# EAGLE board half (EAGLE 9.0.0)
REV: D
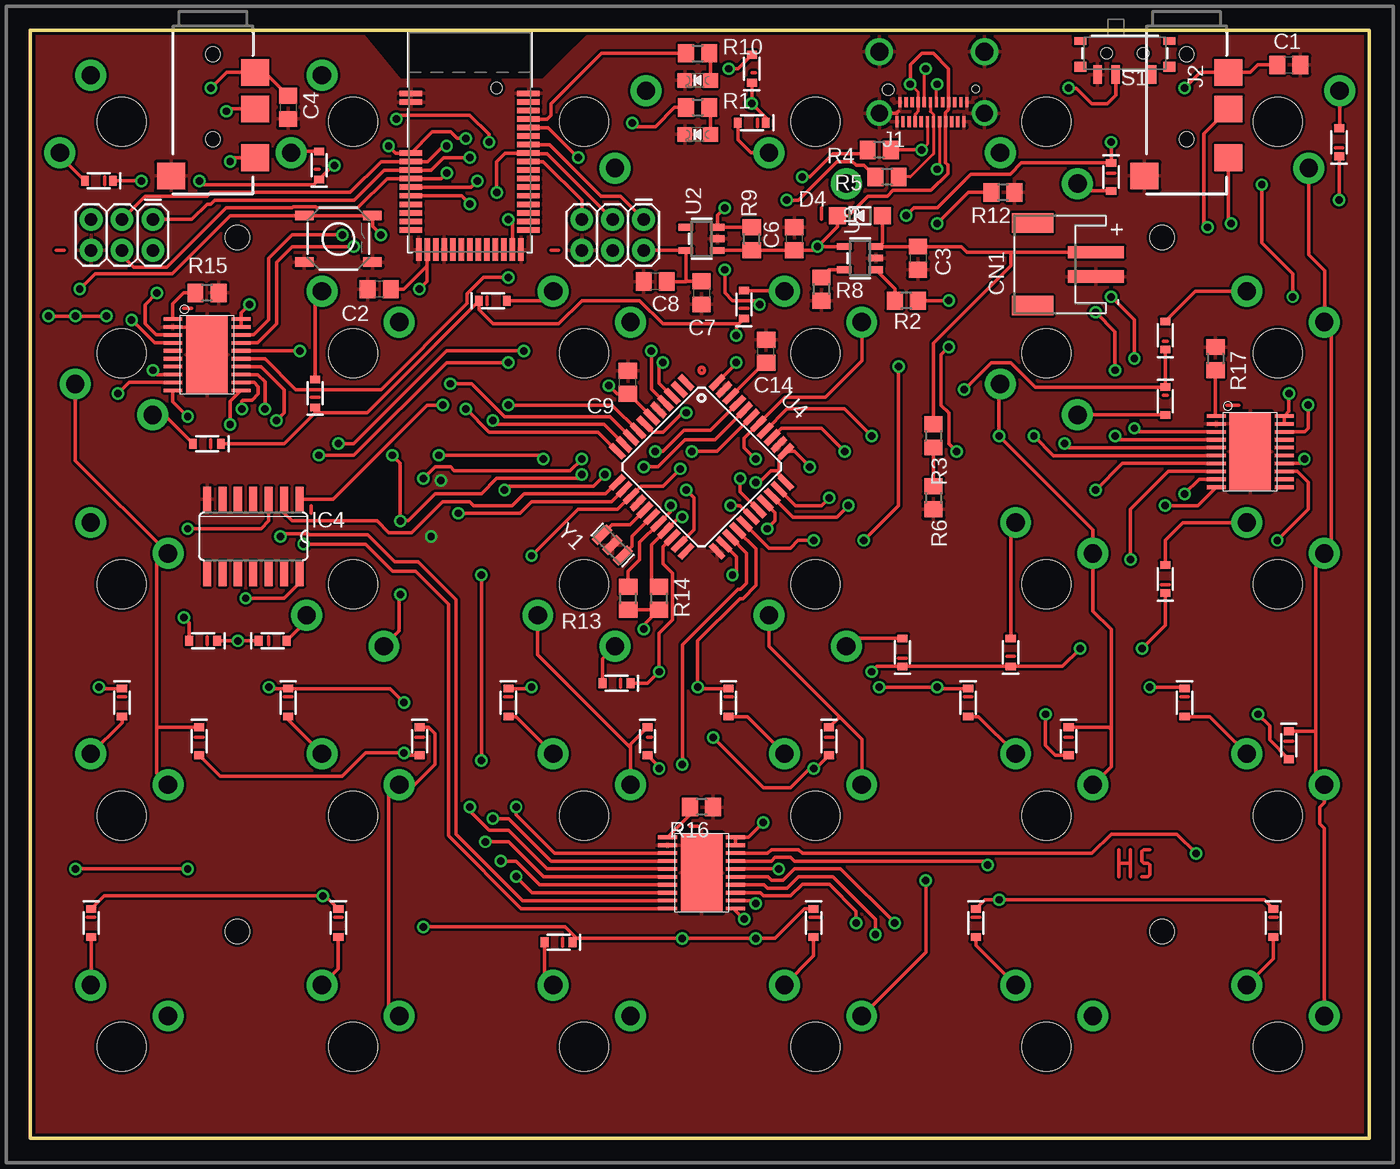
[diagram p3: board, top side]
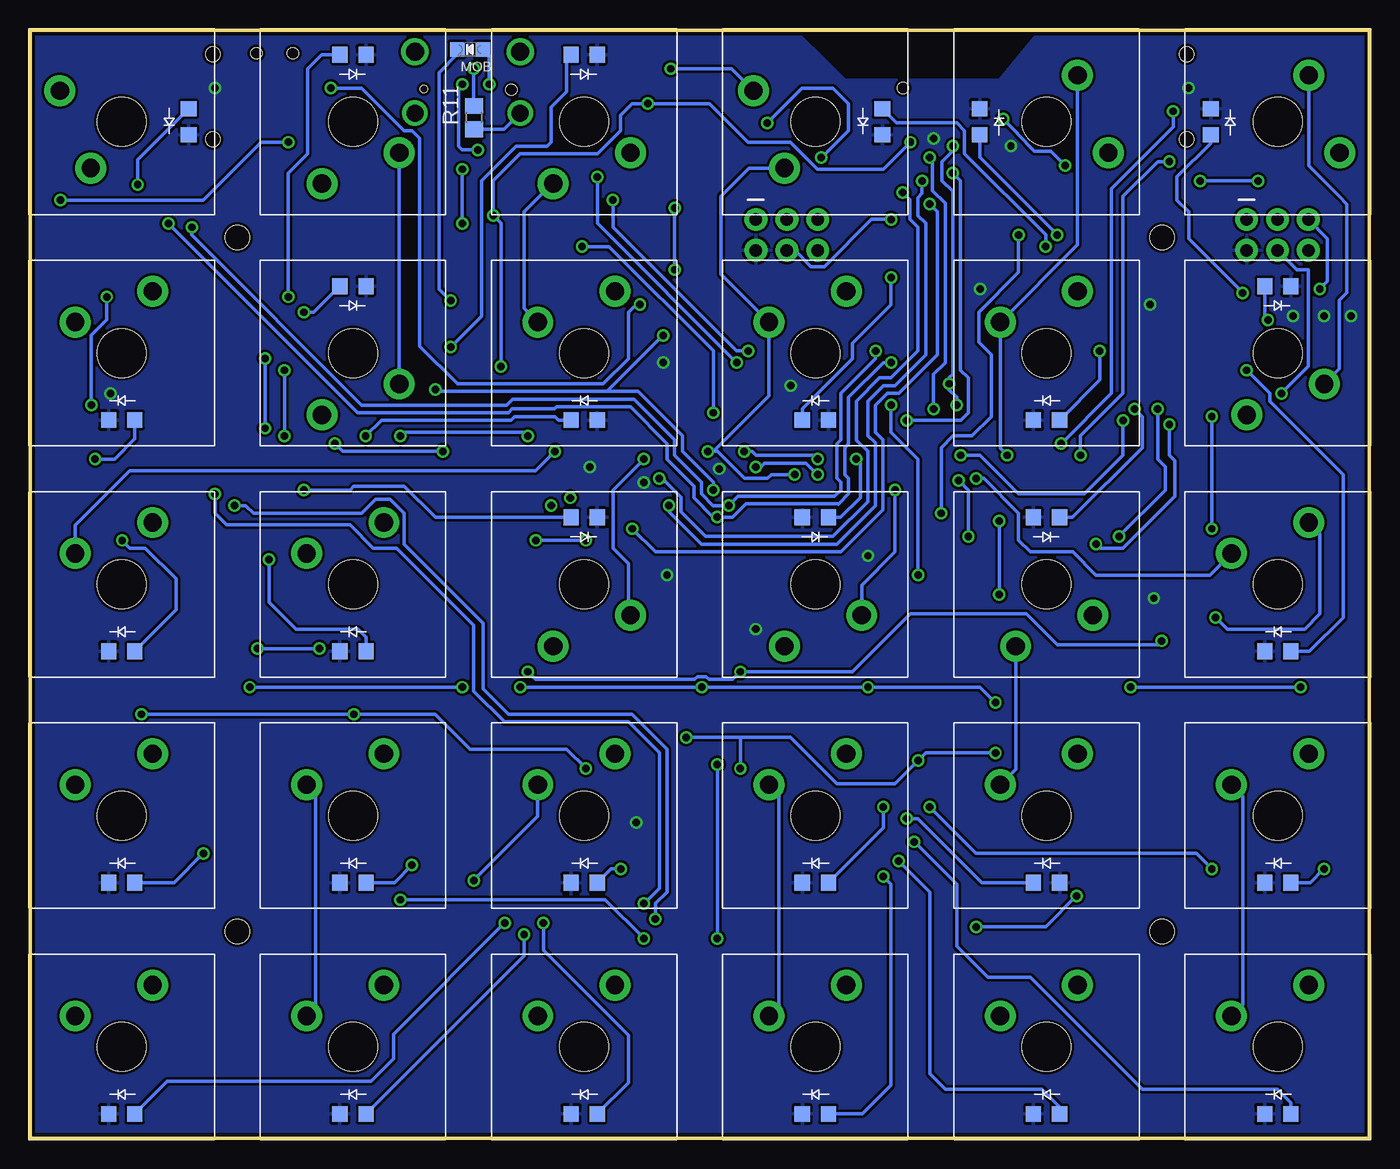
[diagram p4: board, bottom side, seen from below]

Size 110 x 91 mm. Coordinates in mm from the lower left corner, seen from the top.
Outline: 0,0 110,0 110,91 0,91 0,0
Copper layers (1*16): Top 0.035mm / dielectric 1.5mm / Bottom 0.035mm
Design rules "adafruit *": minimum track width 10mil, minimum drill 0.5mm, track to track 8mil, track to pad 8mil, pad to pad 8mil, via to via 8mil, smd to smd 8mil, copper to edge 10mil, drill to drill 8mil, minimum pad ring 10mil, minimum via ring 8mil, stop-mask expansion 2mil, vias tented up to drill 25mil, thermal gap 10mil
Holes 2 mm at 93,74 93,17 17,17 17,74
tKeepout: area 15.2,72.2 to 18.8,75.8; area 91.2,72.2 to 94.8,75.8; area 91.2,15.2 to 94.8,18.8; area 15.2,15.2 to 18.8,18.8

## Footprints (pad centres in the part's own frame; a part is rotated, then mirrored left to right if it is on the bottom)
C0805 = smd 1.3 x 1.5: 1 -0.95,0; 2 0.95,0
JST-PH-2-SMT-RA = smd 1 x 4.6: 1 1,-3.7; 2 -1,-3.7 | smd 1.6 x 3.4: NC1 -3.4,1.5; NC2 3.4,1.5
CHIPLED_0805_NOOUTLINE = smd 1.2 x 1.2: A 0,-1.05; C 0,1.05
SOD-323 = smd 0.63 x 0.83: A 1.15,0; C -1.15,0
SOD-123 = smd 1.4 x 1.4: A 1.85,0; C -1.85,0
HTSSOP20DAP = smd 0.3 x 1.55: 1 -2.925,-2.8; 2 -2.275,-2.8; 3 -1.625,-2.8; 4 -0.975,-2.8; 5 -0.325,-2.8; 6 0.325,-2.8; 7 0.975,-2.8; 8 1.625,-2.8; 9 2.275,-2.8; 10 2.925,-2.8; 11 2.925,2.8; 12 2.275,2.8; 13 1.625,2.8; 14 0.975,2.8; 15 0.325,2.8; 16 -0.325,2.8; 17 -0.975,2.8; 18 -1.625,2.8; 19 -2.275,2.8; 20 -2.925,2.8 | smd 6.5 x 3.4: EXP 0,0
SO14 = smd 0.66 x 2.032: 1 -3.81,-3.073; 2 -2.54,-3.073; 3 -1.27,-3.073; 4 0,-3.073; 5 1.27,-3.073; 6 2.54,-3.073; 7 3.81,-3.073; 8 3.81,3.073; 9 2.54,3.073; 10 1.27,3.073; 11 0,3.073; 12 -1.27,3.073; 13 -2.54,3.073; 14 -3.81,3.073
DX07S0224JJ2_USB-C = smd 0.27 x 0.9: A1 0.975,2.7; A2 1.475,2.7; A3 1.975,2.7; A4 2.475,2.7; A5 2.975,2.7; A6 3.475,2.7; A7 3.975,2.7; A8 4.475,2.7; A9 4.975,2.7; A10 5.475,2.7; A11 5.975,2.7; A12 6.475,2.7 | smd 0.27 x 0.8: B1 6.225,1.1; B2 5.725,1.1; B3 5.225,1.1; B4 4.725,1.1; B5 4.225,1.1; B6 3.725,1.1; B7 3.225,1.1; B8 2.725,1.1; B9 2.225,1.1; B10 1.725,1.1; B11 1.225,1.1; B12 0.725,1.1 | drill 1.4: SHIELD0 -0.72,2; SHIELD1 7.92,2 | drill 1.5: SHIELD2 7.92,-3.05; SHIELD3 -0.72,-3.05 | hole 0.6: 0,0; 0,0 | hole 0.9: 7.2,0.065
AUDIO_JACK_3.5MM_TRRS_SMD_CUI = smd 2.2 x 2.3: EARTH 12.3,-3.45; RING1 6.8,3.45; RING2 3.8,3.45; TIP 10.8,3.45 | hole 1.2: 2.3,0; 9.3,0
2X3 = drill 1.016 pad 1.88: 1 0,0; 2 0,2.54; 3 2.54,0; 4 2.54,2.54; 5 5.08,0; 6 5.08,2.54
R0805 = smd 1.3 x 1.5: 1 -0.95,0; 2 0.95,0
SWITCH_SPST_SMD_A = smd 0.7 x 1.5: 1 -2.25,-1.75; 2 -0.75,-1.75; 3 2.25,-1.75 | smd 1 x 0.6: GND1 -3.65,1; GND3 3.65,1 | smd 1 x 0.8: GND2 -3.65,-1.1; GND4 3.65,-1.1 | hole 0.9: -1.5,0; 1.5,0
TACTILE_SWITCH_SMD_5.2MM = smd 1.524 x 0.762: 1 -2.794,1.905; 2 2.794,1.905; 3 -2.794,-1.905; 4 2.794,-1.905
CHERRY-MX-PM-SMDLED = smd 1.25 x 1.3: LN -1.075,-5.5; LP 1.075,-5.5 | drill 1.5 pad 2.54: SW1 -3.81,2.54; SW2 2.54,5.08 | hole 4: 0,0
BLE_MODULE_RAYTAC_MDBT40 = smd 1.85 x 0.45: 1 -4.825,4; 2 -4.825,3.3; 3 -4.825,-0.9; 4 -4.825,-1.6; 5 -4.825,-2.3; 6 -4.825,-3; 7 -4.825,-3.7; 8 -4.825,-4.4; 9 -4.825,-5.1; 10 -4.825,-5.8; 11 -4.825,-6.5; 12 -4.825,-7.2; 26 4.825,-7.2; 27 4.825,-6.5; 28 4.825,-5.8; 29 4.825,-5.1; 30 4.825,-4.4; 31 4.825,-3.7; 32 4.825,-3; 33 4.825,-2.3; 34 4.825,-1.6; 35 4.825,-0.9; 36 4.825,-0.2; 37 4.825,0.5; 38 4.825,1.2; 39 4.825,1.9; 40 4.825,2.6; 41 4.825,3.3; 42 4.825,4 | smd 0.45 x 1.85: 13 -4.2,-8.825; 14 -3.5,-8.825; 15 -2.8,-8.825; 16 -2.1,-8.825; 17 -1.4,-8.825; 18 -0.7,-8.825; 19 0,-8.825; 20 0.7,-8.825; 21 1.4,-8.825; 22 2.1,-8.825; 23 2.8,-8.825; 24 3.5,-8.825; 25 4.2,-8.825 | hole 0.9: 2.2,4.45
SOT23-5 = smd 0.55 x 1.2: 1 -0.95,-1.3; 2 0,-1.3; 3 0.95,-1.3; 4 0.95,1.3; 5 -0.95,1.3
TQFP44 = smd 1.5 x 0.5: 1 -5.8,4; 2 -5.8,3.2; 3 -5.8,2.4; 4 -5.8,1.6; 5 -5.8,0.8; 6 -5.8,0; 7 -5.8,-0.8; 8 -5.8,-1.6; 9 -5.8,-2.4; 10 -5.8,-3.2; 11 -5.8,-4; 23 5.8,-4; 24 5.8,-3.2; 25 5.8,-2.4; 26 5.8,-1.6; 27 5.8,-0.8; 28 5.8,0; 29 5.8,0.8; 30 5.8,1.6; 31 5.8,2.4; 32 5.8,3.2; 33 5.8,4 | smd 0.5 x 1.5: 12 -4,-5.8; 13 -3.2,-5.8; 14 -2.4,-5.8; 15 -1.6,-5.8; 16 -0.8,-5.8; 17 0,-5.8; 18 0.8,-5.8; 19 1.6,-5.8; 20 2.4,-5.8; 21 3.2,-5.8; 22 4,-5.8; 34 4,5.8; 35 3.2,5.8; 36 2.4,5.8; 37 1.6,5.8; 38 0.8,5.8; 39 0,5.8; 40 -0.8,5.8; 41 -1.6,5.8; 42 -2.4,5.8; 43 -3.2,5.8; 44 -4,5.8
RESONATOR-SMD = smd 0.7 x 1.7: 1 -1.2,0; 2 0,0; 3 1.2,0

## Placement (x,y rotation side)
C1  10uF  [C0805]  103.41,88.17 0 top
C2  1uF  [C0805]  28.67,69.74 180 top
C3  0.22  [C0805]  72.93,72.3 270 top
C4  10uF  [C0805]  21.18,84.68 270 top
C6  0.22  [C0805]  62.77,73.88 90 top
C7  1uF  [C0805]  55.15,69.44 270 top
C8  10µF  [C0805]  51.34,70.38 180 top
C9  10uF  [C0805]  49.09,62.09 90 top
C14  1uF  [C0805]  60.46,64.65 90 top
CN1  [JST-PH-2-SMT-RA]  83.85,71.79 90 top
D1  RED  [CHIPLED_0805_NOOUTLINE]  54.83,82.45 90 top
D2  BLUE  [CHIPLED_0805_NOOUTLINE]  54.83,86.9 90 top
D3  250mA/100V  [SOD-323]  5.62,78.64 180 top
D4  MBR120  [SOD-123]  68.17,75.79 0 top
D5  250mA/100V  [SOD-323]  23.72,79.92 90 top
D6  250mA/100V  [SOD-323]  59.28,87.85 90 top
D7  250mA/100V  [SOD-323]  59.28,83.41 180 top
D8  250mA/100V  [SOD-323]  88.81,78.96 270 top
D9  250mA/100V  [SOD-323]  107.54,81.82 90 top
D10  250mA/100V  [SOD-323]  14.51,57.05 180 top
D11  250mA/100V  [SOD-323]  23.4,61.18 90 top
D12  250mA/100V  [SOD-323]  38.01,68.8 0 top
D13  250mA/100V  [SOD-323]  58.64,68.48 90 top
D14  250mA/100V  [SOD-323]  93.25,60.55 270 top
D15  250mA/100V  [SOD-323]  93.25,65.94 90 top
D16  250mA/100V  [SOD-323]  4.99,17.68 270 top
D17  250mA/100V  [SOD-323]  25.3,17.68 270 top
D18  250mA/100V  [SOD-323]  43.4,16.1 180 top
D19  250mA/100V  [SOD-323]  64.36,17.68 270 top
D20  250mA/100V  [SOD-323]  77.69,17.68 270 top
D21  250mA/100V  [SOD-323]  102.14,17.68 270 top
D22  250mA/100V  [SOD-323]  7.53,35.78 270 top
D23  250mA/100V  [SOD-323]  21.18,35.78 270 top
D24  250mA/100V  [SOD-323]  39.27,35.78 270 top
D25  250mA/100V  [SOD-323]  57.37,35.78 270 top
D26  250mA/100V  [SOD-323]  77.06,35.78 270 top
D27  250mA/100V  [SOD-323]  94.84,35.78 270 top
D28  250mA/100V  [SOD-323]  14.19,40.86 180 top
D29  250mA/100V  [SOD-323]  19.91,40.86 0 top
D30  250mA/100V  [SOD-323]  48.16,37.37 180 top
D31  250mA/100V  [SOD-323]  71.66,39.91 90 top
D32  250mA/100V  [SOD-323]  80.55,39.91 90 top
D33  250mA/100V  [SOD-323]  93.25,45.94 90 top
D34  250mA/100V  [SOD-323]  13.88,32.61 270 top
D35  250mA/100V  [SOD-323]  31.97,32.61 270 top
D36  250mA/100V  [SOD-323]  50.7,32.61 270 top
D37  250mA/100V  [SOD-323]  65.63,32.61 270 top
D38  250mA/100V  [SOD-323]  85.31,32.61 270 top
D39  250mA/100V  [SOD-323]  103.41,32.29 270 top
IC1  TLC59711  [HTSSOP20DAP]  14.51,64.36 270 top
IC2  TLC59711  [HTSSOP20DAP]  55.15,21.8 270 top
IC3  TLC59711  [HTSSOP20DAP]  100.23,56.4 270 top
IC4  74HC08D  [SO14]  18.32,49.44 180 top
J1  [DX07S0224JJ2_USB-C]  77.68,86.2 180 top
J2  AUDIO_JACK_TRRSCUI  [AUDIO_JACK_3.5MM_TRRS_SMD_CUI]  95,91.35 270 top
J3  AUDIO_JACK_TRRSCUI  [AUDIO_JACK_3.5MM_TRRS_SMD_CUI]  15,91.35 270 top
J4  FEMALE 2x3  [2X3]  50.39,75.47 180 top
J5  FEMALE 2x3  [2X3]  10.06,75.47 180 top
MOB  ORANGE  [CHIPLED_0805_NOOUTLINE]  73.88,89.44 90 bottom
R1  2.2K  [R0805]  54.83,84.68 0 top
R2  0.22  [R0805]  71.98,68.8 180 top
R3  100K  [R0805]  74.2,57.69 270 top
R4  22  [R0805]  69.75,81.19 180 top
R5  22  [R0805]  70.39,78.96 180 top
R6  100K  [R0805]  74.2,52.61 270 top
R8  0.22  [R0805]  64.99,69.75 270 top
R9  100K  [R0805]  59.28,73.88 90 top
R10  2.2K  [R0805]  54.83,89.12 0 top
R11  5k1  [R0805]  73.54,83.84 90 bottom
R12  5k1  [R0805]  79.92,77.69 180 top
R13  2.2K  [R0805]  49.12,44.35 90 top
R14  2.2K  [R0805]  51.66,44.35 90 top
R15  1.5k  [R0805]  14.51,69.44 180 top
R16  1.5k  [R0805]  55.15,27.21 180 top
R17  1.5k  [R0805]  97.38,64.04 270 top
S1  [SWITCH_SPST_SMD_A]  89.93,89.12 0 top
S2  [TACTILE_SWITCH_SMD_5.2MM]  25.3,73.88 0 top
SW11  CHERRY-MX-LEDSMD  [CHERRY-MX-PM-SMDLED]  102.5,83.5 90 bottom
SW12  CHERRY-MX-LEDSMD  [CHERRY-MX-PM-SMDLED]  83.5,83.5 180 bottom
SW13  CHERRY-MX-LEDSMD  [CHERRY-MX-PM-SMDLED]  64.5,83.5 180 bottom
SW14  CHERRY-MX-LEDSMD  [CHERRY-MX-PM-SMDLED]  45.5,83.5 90 bottom
SW15  CHERRY-MX-LEDSMD  [CHERRY-MX-PM-SMDLED]  26.5,83.5 270 bottom
SW16  CHERRY-MX-LEDSMD  [CHERRY-MX-PM-SMDLED]  7.5,83.5 270 bottom
SW21  CHERRY-MX-LEDSMD  [CHERRY-MX-PM-SMDLED]  102.5,64.5 0 bottom
SW22  CHERRY-MX-LEDSMD  [CHERRY-MX-PM-SMDLED]  83.5,64.5 180 bottom
SW23  CHERRY-MX-LEDSMD  [CHERRY-MX-PM-SMDLED]  64.5,64.5 0 bottom
SW24  CHERRY-MX-LEDSMD  [CHERRY-MX-PM-SMDLED]  45.5,64.5 0 bottom
SW25  CHERRY-MX-LEDSMD  [CHERRY-MX-PM-SMDLED]  26.5,64.5 0 bottom
SW26  CHERRY-MX-LEDSMD  [CHERRY-MX-PM-SMDLED]  7.5,64.5 180 bottom
SW31  CHERRY-MX-LEDSMD  [CHERRY-MX-PM-SMDLED]  102.5,45.5 0 bottom
SW32  CHERRY-MX-LEDSMD  [CHERRY-MX-PM-SMDLED]  83.5,45.5 0 bottom
SW33  CHERRY-MX-LEDSMD  [CHERRY-MX-PM-SMDLED]  64.5,45.5 180 bottom
SW34  CHERRY-MX-LEDSMD  [CHERRY-MX-PM-SMDLED]  45.5,45.5 180 bottom
SW35  CHERRY-MX-LEDSMD  [CHERRY-MX-PM-SMDLED]  26.5,45.5 180 bottom
SW36  CHERRY-MX-LEDSMD  [CHERRY-MX-PM-SMDLED]  7.5,45.5 0 bottom
SW41  CHERRY-MX-LEDSMD  [CHERRY-MX-PM-SMDLED]  102.5,26.5 0 bottom
SW42  CHERRY-MX-LEDSMD  [CHERRY-MX-PM-SMDLED]  83.5,26.5 0 bottom
SW43  CHERRY-MX-LEDSMD  [CHERRY-MX-PM-SMDLED]  64.5,26.5 0 bottom
SW44  CHERRY-MX-LEDSMD  [CHERRY-MX-PM-SMDLED]  45.5,26.5 0 bottom
SW45  CHERRY-MX-LEDSMD  [CHERRY-MX-PM-SMDLED]  26.5,26.5 0 bottom
SW46  CHERRY-MX-LEDSMD  [CHERRY-MX-PM-SMDLED]  7.5,26.5 0 bottom
SW51  CHERRY-MX-LEDSMD  [CHERRY-MX-PM-SMDLED]  102.5,7.5 0 bottom
SW52  CHERRY-MX-LEDSMD  [CHERRY-MX-PM-SMDLED]  83.5,7.5 0 bottom
SW53  CHERRY-MX-LEDSMD  [CHERRY-MX-PM-SMDLED]  64.5,7.5 0 bottom
SW54  CHERRY-MX-LEDSMD  [CHERRY-MX-PM-SMDLED]  45.5,7.5 0 bottom
SW55  CHERRY-MX-LEDSMD  [CHERRY-MX-PM-SMDLED]  26.5,7.5 0 bottom
SW56  CHERRY-MX-LEDSMD  [CHERRY-MX-PM-SMDLED]  7.5,7.5 0 bottom
U1  MBT40  [BLE_MODULE_RAYTAC_MDBT40]  36.1,81.82 0 top
U2  SPX3819-3.3  [SOT23-5]  55.15,73.88 90 top
U3  MCP73831T-2ACI/OT  [SOT23-5]  68.17,72.3 90 top
U4  32U4  [TQFP44]  55.15,55.15 315 top
Y1  8MHz  [RESONATOR-SMD]  47.82,48.73 135 top

## Tracks (layer width: path | path; a pad name or v marks a point on that pad's centre or on a via)
9
  Top 0.305: R3.2 R6.1
+3V3  (via drill 0.61, 0.61 pad 0.61)
  Top 0.305: U4.33 61.5,54.46 61.5,54.83 | 61.5,54.83 61.5,55.84 U4.34 62.77,56.42 v64.04,55.15 | C2.1 30.68,69.74 32.6,71.66 U1.14 32.6,70.38 v31.97,69.75 | U4.44 58.01,63.66 v58.01,63.72 | U4.24 58.01,47.77 58.01,46.58 v57.69,46.26 | J4.2 50.48,73.02 50.57,72.93 U2.5 53.88,72.9 53.88,70.39 | C7.1 53.88,70.39 | U4.6 49.16,61.14 C9.1 48.2,61.14 v47.53,61.82 | v14.83,86.27 16.11,87.55 J3.RING2 19.26,87.55 C4.1 | v94.84,86.27 96.12,87.55 J2.RING2 100.25,87.55 100.87,88.17 C1.1 | 61.5,54.83 60.87,54.83 59.91,53.88 v59.59,53.88 | v41.18,47.85 44.99,51.66 48.26,51.66 U4.14 50.17,53.56 51.98,53.56 v53.4,54.99 | C8.1 53.87,70.38 53.88,70.39 | v35.78,82.14 35.06,82.14 34.54,82.66 33.01,82.66 U1.3 30.02,80.92 v29.43,81.5 | v6.26,67.53 v3.71,67.53 v1.49,67.53 | IC1.19 IC1.20 17.31,67.79 v18,68.48 | IC2.19 IC2.20 59.01,24.72 v60.23,25.94 | 22.16,46.39 IC4.14 22.13,45.62 20.86,44.35 v17.68,44.35 | IC3.19 IC3.20 103.41,59.7 v103.41,61.18 | R13.1 R14.1 50.39,42.13 v50.39,41.81
  pour Bottom: -2,-2 112,-2 112,93 48.48,92.3 43.09,86.9 30.38,86.9 25.62,92.68 -2,93
AREF
  Top 0.305: U4.42 60.3,63.7 C14.1
CONNECTED
  Top 0.305: U1.39 42.46,83.72 42.78,84.04 42.78,85 46.91,89.12 R10.1
D++
  Top 0.254: J1.B6 73.95,84.35 74.2,84.1 J1.A6 74.2,80.87 72.3,78.96 R5.1
D--  (via drill 0.61)
  Top 0.254: J1.A7 73.7,81.64 v73.25,81.19 | J1.B7 74.45,86.52 v74.52,86.58
  Top 0.305: v73.25,81.19 R4.1
  Bottom 0.305: v74.52,86.58 74.83,86.27 74.83,81.5 74.52,81.19 v73.25,81.19
DFU  (via drill 0.61)
  Top 0.305: U1.24 39.6,75.14 v39.27,75.47
  Bottom 0.305: v39.27,75.47 40.88,75.47 44.76,71.6 45.86,71.6 47.19,72.93 J4.4
EN  (via drill 0.61)
  Top 0.305: R9.2 U2.3 56.45,75.82 v57.05,76.42 | v57.05,71.34 57.05,69.44 57.69,68.8 59.59,68.8 v59.91,68.48 | S1.2 89.18,85.67 88.5,85 87.23,85 85.97,86.27 v85.31,86.27
  Bottom 0.305: v85.31,86.27 82.77,86.27 79.28,82.77 78.64,82.77 78.01,82.14 78.01,65.08 74.91,61.98 62.93,61.98 60.87,64.04 60.87,67.85 60.23,68.48 v59.91,68.48 | v57.05,76.42 v57.05,71.34
FCTRYRST
  Top 0.305: U1.34 42.12,80.22 42.13,80.23 45.31,77.06 J4.5
GND  (via drill 0.61)
  Top 0.305: J1.SHIELD1 71.19,84.2 71.34,84.36 | IC3.EXP 100.23,57.69 101.5,58.96 | IC1.2 14.56,66.63 | 14.56,66.63 14.83,66.9 | 14.56,66.63 14.51,66.58 IC1.EXP
  Bottom 0.305: R11.1 71.07,82.89 J1.SHIELD1 | v32.92,49.44 32.92,53.24 v33.72,54.04
  pour Top: -2,93 -2,-2 112,-2 112,93 47.53,92.3 42.13,86.9 30.38,86.9 25.62,92.68
LED0  (via drill 0.61)
  Top 0.305: IC1.3 10.35,65.98 9.43,66.9 9.43,68.48 v10.38,69.44
  Bottom 0.305: v10.38,69.44 14.83,73.88 14.83,76.11 15.78,77.06 15.78,78.96 13,81.74 SW16.LP
LED1  (via drill 0.61)
  Top 0.305: IC1.4 10.2,65.33 v8.32,67.22
  Bottom 0.305: SW26.LP 8.57,67.47 v8.32,67.22
LED5  (via drill 0.61)
  Top 0.305: IC1.8 10.42,62.73 v10.06,63.09
  Bottom 0.305: v10.06,63.09 8.16,61.18 8.16,60.55 2.13,54.52 2.13,42.77 4.89,40 SW36.LP
LED6  (via drill 0.61)
  Top 0.305: IC1.13 18.68,62.73 19.27,62.14 v19.27,59.91
  Bottom 0.305: v19.27,59.91 18.64,59.28 18.64,56.74 24.38,51 SW35.LN
LED7  (via drill 0.61)
  Top 0.305: IC1.14 18.98,63.38 20.86,61.5 20.86,59.59 v20.23,58.96 | v42.13,55.78 41.81,56.1 v33.56,56.1
  Bottom 0.305: SW34.LN 43.42,51 41.81,52.61 41.81,55.47 v42.13,55.78 | v33.56,56.1 31.97,56.1 28.8,52.93 23.4,52.93 20.23,56.1 v20.23,58.96
LED8  (via drill 0.61)
  Top 0.305: IC1.15 19.28,64.03 21.81,61.5 28.8,61.5 35.89,68.59 35.89,69.35 37.25,70.71 v39.27,70.71
  Bottom 0.305: v39.27,70.71 39.27,68.48 42.45,65.31 42.45,64.04 46.58,59.91 SW24.LN
LED9  (via drill 0.61)
  Top 0.305: IC1.16 22.12,64.68 v22.13,64.67
  Bottom 0.305: SW25.LP 22.13,62.3 v22.13,64.67
LED10  (via drill 0.61)
  Top 0.305: 17.33,65.31 IC1.17 18.68,65.33 20.24,66.9 20.24,71.98 21.51,73.25 v26.57,73.25
  Bottom 0.305: SW14.LP 38.83,83.41 33.88,83.41 33.24,82.77 33.24,80.87 26.57,74.2 v26.57,73.25
LED11  (via drill 0.61)
  Top 0.305: IC1.18 18.36,65.98 19.59,67.22 19.59,72.3 21.5,74.2 v25.62,74.2
  Bottom 0.305: SW15.LP 32,80.59 26.12,74.71 26.12,74.69 v25.62,74.2
LED12  (via drill 0.61 pad 0.61)
  Top 0.305: IC2.3 51.04,23.42 51.02,23.4 43.09,23.4 39.91,26.57 v39.91,27.21
  Bottom 0.305: SW44.LP 39.91,25.52 v39.91,27.21
LED13  (via drill 0.61 pad 0.61)
  Top 0.305: v38.01,26.26 39.27,26.26 42.77,22.77 51.34,22.77 IC2.4
  Bottom 0.305: v38.01,26.26 37.05,26.26 31.8,21 SW45.LN
LED14  (via drill 0.61 pad 0.61)
  Top 0.305: IC2.5 42.46,22.12 39.27,25.3 37.69,25.3 36.1,26.89 v36.1,27.21 | v12.92,22.13 v3.71,22.13
  Bottom 0.305: SW46.LP 4.84,21 v3.71,22.13 | v36.1,27.21 32.29,23.4 14.19,23.4 v12.92,22.13
LED15  (via drill 0.61 pad 0.61)
  Top 0.305: v37.37,24.35 39.27,24.35 42.16,21.47 IC2.6
  Bottom 0.305: v37.37,24.35 33.88,20.86 33.88,15.78 31.34,13.24 27.84,13.24 18.64,4.03 7.53,4.03 6.43,2.93 SW56.LP
LED16  (via drill 0.61 pad 0.61)
  Top 0.305: IC2.7 41.85,20.82 39.91,22.77 v38.64,22.77
  Bottom 0.305: v38.64,22.77 36.1,20.23 36.1,5.3 34.83,4.03 26.89,4.03 25.43,2.57 SW55.LP
LED17  (via drill 0.61 pad 0.61)
  Top 0.305: IC2.8 41.23,20.17 v39.91,21.5
  Bottom 0.305: SW54.LP 41.62,2 39.27,4.35 39.27,20.86 v39.91,21.5
LED18  (via drill 0.61 pad 0.61)
  Top 0.305: IC2.13 59.98,20.17 60.25,19.91 62.47,19.91 63.42,20.86 65.64,20.86 67.85,18.66 v67.85,17.68
  Bottom 0.305: v67.85,17.68 67.85,15.46 60.87,8.48 60.87,4.56 SW53.LP
LED19  (via drill 0.61 pad 0.61)
  Top 0.305: v69.44,16.73 69.44,18 65.94,21.5 63.11,21.5 62.15,20.54 60.56,20.54 60.29,20.82 IC2.14
  Bottom 0.305: v69.44,16.73 69.44,14.99 SW52.LP
LED20  (via drill 0.61 pad 0.61)
  Top 0.305: IC2.15 60.59,21.47 60.88,21.18 61.84,21.18 62.79,22.13 66.58,22.13 v71.03,17.68
  Bottom 0.305: v71.03,17.68 80.17,8.54 80.17,6.51 82.01,4.67 98.76,4.67 SW51.LP
LED21  (via drill 0.61 pad 0.61)
  Top 0.305: IC2.16 v61.51,22.12 v61.5,22.13
  Bottom 0.305: SW43.LP 62.3,22.13 v61.5,22.13
LED22  (via drill 0.61 pad 0.61)
  Top 0.305: IC2.17 60.89,22.77 61.2,23.08 62.47,23.08 62.79,22.77 78.33,22.77 v78.64,22.45
  Bottom 0.305: SW42.LP 80.09,21 v78.64,22.45
LED23  (via drill 0.61 pad 0.61)
  Top 0.305: v95.79,23.4 94.2,24.99 88.81,24.99 87.22,23.4 63.42,23.4 63.11,23.72 60.88,23.72 60.59,23.42 IC2.18
  Bottom 0.305: SW41.LP 98.19,21 v95.79,23.4
LED24  (via drill 0.61 pad 0.61)
  Top 0.305: IC3.3 91.01,58.03 v90.71,58.33 | v88.81,69.12 90.71,67.22 v90.71,64.04
  Bottom 0.305: SW12.LP 86.07,89 87.22,87.85 87.22,80.87 88.81,79.28 v88.81,69.12 | v90.71,64.04 v90.71,58.33
LED25  (via drill 0.61 pad 0.61)
  Top 0.305: IC3.4 89.44,57.38 v89.12,57.69 | v87.53,67.85 89.12,66.26 v89.12,63.09
  Bottom 0.305: SW22.LP 86.72,67.85 v87.53,67.85 | v89.12,63.09 v89.12,57.69
LED26  (via drill 0.61 pad 0.61)
  Top 0.305: v75.47,64.99 74.83,64.36 74.83,60.23 75.47,59.59 75.47,57.05 v76.11,56.42 | IC3.5 85.32,56.73 v85,57.05
  Bottom 0.305: v75.47,64.99 72.93,67.53 72.93,78.66 70.09,81.5 67.55,81.5 67.23,81.82 67.23,84.68 65.96,85.95 65.96,88.61 SW13.LP | v76.11,56.42 84.36,56.42 v85,57.05
LED27  (via drill 0.61 pad 0.61)
  Top 0.305: IC3.6 84.07,56.08 v82.45,57.69
  Bottom 0.305: SW23.LN 66.62,59 66.9,59.28 70.22,59.28 70.5,59 81.15,59 v82.45,57.69
LED28  (via drill 0.61 pad 0.61)
  Top 0.305: IC3.7 89.72,55.43 v87.53,53.24
  Bottom 0.305: SW33.LP 76.72,51 79.28,53.56 83.42,53.56 83.74,53.24 v87.53,53.24
LED29  (via drill 0.61 pad 0.61)
  Top 0.305: IC3.8 93.51,54.78 90.39,51.66 v90.39,47.53
  Bottom 0.305: SW32.LP 82.42,41.15 83.09,41.81 88.17,41.81 90.39,44.04 v90.39,47.53
LED30  (via drill 0.61)
  Top 0.305: IC3.13 104.1,54.78 105,53.88 105,51.66 v102.46,49.12
  Bottom 0.305: v102.46,49.12 101.82,48.48 100.55,48.48 98.01,45.94 98.01,43.41 SW31.LP
LED31  (via drill 0.61)
  Top 0.305: IC3.14 104.32,55.43 v104.68,55.78
  Bottom 0.305: SW21.LP 101.42,57.45 103.09,55.78 v104.68,55.78
LED35  (via drill 0.61)
  Top 0.305: v101.19,78.33 101.19,73.56 103.73,71.03 v103.73,69.12 | IC3.18 104.7,58.03 105,58.33 v105,60.23
  Bottom 0.305: SW11.LP 101.19,80.39 v101.19,78.33 | v105,60.23 105,65.94 103.73,67.22 v103.73,69.12
LEDDAT2  (via drill 0.61)
  Top 0.305: IC1.12 18.37,62.08 18.73,61.72 18.73,61.15 18.22,60.63 17.45,60.63 17.37,60.55 v17.37,59.91 | IC2.9 40.44,19.52 34.97,24.99 34.97,44.23 31.84,47.35 29.94,47.35 27.72,49.58 22.89,49.58 22.8,49.66 20.77,49.66 v20.54,49.44
  Bottom 0.305: v17.37,59.91 17.37,55.78 16.73,55.15 16.73,53.24 v20.54,49.44
LEDDAT3  (via drill 0.61)
  Top 0.305: IC2.12 59.35,19.52 v59.59,19.27 | IC3.9 96.04,54.13 v94.84,52.93
  Bottom 0.305: v59.59,19.27 58.33,20.54 58.33,31.66 60.87,34.2 71.03,34.2 73.56,36.73 73.56,42.13 79.92,48.48 81.82,48.48 83.72,50.39 93.89,50.39 94.84,51.34 v94.84,52.93
LEDSCK1  (via drill 0.61)
  Top 0.305: IC4.3 19.59,50.7 18.95,50.07 v12.92,50.07 | IC1.10 11.71,60.49 v12.92,59.28
  Bottom 0.305: v12.92,59.28 v12.92,50.07
LEDSCK2  (via drill 0.61)
  Top 0.305: IC1.11 17.29,61.41 17.27,61.41 16.41,60.56 v16.41,58.64 | IC2.10 40.31,18.87 34.35,24.83 34.35,43.88 31.66,46.58 29.75,46.58 27.53,48.8 v22.45,48.8
  Bottom 0.305: v16.41,58.64 16.41,56.11 15.96,55.66 15.96,52.75 20.23,48.48 22.13,48.48 v22.45,48.8
LEDSCK3  (via drill 0.61)
  Top 0.305: IC2.11 57.95,18.7 v58.64,18 | IC3.10 95.93,51.98 v93.25,51.98
  Bottom 0.305: v93.25,51.98 92.3,51.98 91.66,51.34 82.77,51.34 81.61,52.5 80.44,52.5 79.28,51.34 79.28,48.81 72.79,42.32 72.79,36.92 70.7,34.83 60.56,34.83 57.71,31.97 57.71,20.23 58.64,19.29 v58.64,18
MODE  (via drill 0.61 pad 0.61)
  Top 0.305: U1.38 42.54,83.02 v45.01,80.55 | R1.1 52.95,84.68 51.36,83.09 49.77,83.09 v49.45,83.41
  Bottom 0.305: v45.01,80.55 42.78,82.77 42.78,85 44.05,86.27 46.59,86.27 v49.45,83.41
N$1  (via drill 0.61)
  Top 0.305: v75.47,68.8 R2.1
  Bottom 0.305: MOB.C 74.93,89.03 76.42,87.53 76.42,69.75 v75.47,68.8
N$2
  Top 0.305: D29.A 22.69,42.49 SW35.SW1
N$3
  Top 0.305: U3.1 71.03,69.78 R2.2
N$4
  Top 0.305: U3.5 65.63,71.34 R8.1
N$5
  Top 0.305: R1.2 55.88,84.58 D1.A
N$6
  Top 0.305: R10.2 55.88,89.02 D2.A
N$7
  Top 0.305: Y1.1 49.44,48.64 49.44,49.44 U4.17
N$8
  Top 0.305: U4.16 49.26,50.39 47.79,50.39 Y1.3
N$9  (via drill 0.61)
  Top 0.305: U4.4 51.02,61.54 v51.02,64.67 | R5.2 68.49,79.92 67.87,79.92 67.55,80.23 66.28,80.23 63.11,77.06 v62.14,77.06
  Bottom 0.305: v51.02,64.67 51.98,64.67 62.14,74.83 v62.14,77.06
N$10  (via drill 0.61)
  Top 0.305: U4.3 51.66,62.04 51.66,63.41 v51.98,63.72 | v63.41,78.96 64.06,78.96 65.96,80.87 68.49,80.87 R4.2
  Bottom 0.305: v51.98,63.72 63.41,75.15 v63.41,78.96
N$11  (via drill 0.61)
  Top 0.254: J1.A5 74.7,79.78 v74.52,79.6
  Top 0.305: R12.2 77.06,77.69 v74.52,75.15
  Bottom 0.305: v74.52,79.6 v74.52,75.15
N$12  (via drill 0.61)
  Top 0.254: J1.B5 73.45,87.74 v73.56,87.85
  Bottom 0.305: R11.2 73.56,84.82 v73.56,87.85
N$13
  Top 0.305: D3.A 2.42,80.69 SW16.SW2
N$14
  Top 0.305: 38.96,36.26 39.59,36.26
N$15
  Top 0.305: 20.86,36.26 21.5,36.26
N$16
  Top 0.305: SW15.SW2 21.52,81.06 D5.A
N$17  (via drill 0.61)
  Top 0.305: D6.A 58.13,87.85 v57.37,87.85
  Bottom 0.305: SW14.SW2 52.39,87.85 v57.37,87.85
N$18
  Top 0.305: 7.84,36.26 7.21,36.26
N$19
  Top 0.305: 57.05,36.26 57.69,36.26
N$20
  Top 0.305: SW13.SW1 59.2,80.96 58.13,82.03 D7.A
N$21
  Top 0.305: SW12.SW2 86.65,77.81 D8.A
N$22
  Top 0.305: D9.A 107.58,83.01 SW11.SW2
N$23
  Top 0.305: 71.34,39.43 71.98,39.43
N$24
  Top 0.305: SW26.SW2 10.99,59.42 D10.A
N$25
  Top 0.305: D11.A 23.4,69.02 SW25.SW2
N$26
  Top 0.305: D12.A 42.18,68.8 SW24.SW2
N$27
  Top 0.305: D13.A 61.91,69.64 SW23.SW2
N$28
  Top 0.305: SW22.SW2 93.23,59.42 D14.A
N$29
  Top 0.305: D15.A 95.73,69.58 SW21.SW2
N$30
  Top 0.305: 76.74,36.26 77.38,36.26
N$31
  Top 0.305: D16.A 4.99,12.61 SW56.SW2
N$32
  Top 0.305: D17.A 25.3,13.93 SW55.SW2
N$33
  Top 0.305: D18.A 42.25,13.29 SW54.SW2
N$34
  Top 0.305: D19.A 64.36,14.98 SW53.SW2
N$35
  Top 0.305: SW52.SW2 77.69,15.85 D20.A
N$36
  Top 0.305: D21.A 102.14,14.76 SW51.SW2
N$38
  Top 0.305: SW46.SW2 7.53,34.15 D22.A
N$39
  Top 0.305: SW45.SW2 21.18,34.36 D23.A
N$40
  Top 0.305: SW44.SW2 39.91,34.63 D24.A
N$41
  Top 0.305: SW43.SW2 58.91,34.63 D25.A
N$42
  Top 0.305: SW42.SW2 77.91,34.63 D26.A
N$43
  Top 0.305: SW41.SW2 96.91,34.63 D27.A
N$44
  Top 0.305: 94.52,36.26 95.16,36.26
N$45  (via drill 0.61)
  Top 0.305: D28.A 13.04,42.33 v12.61,42.77
  Bottom 0.305: SW36.SW2 4.03,49.65 4.03,43.09 5.3,41.81 11.65,41.81 v12.61,42.77
N$46
  Top 0.305: 23.4,79.6 23.72,79.6
N$47
  Top 0.305: SW34.SW2 47.02,39.4 D30.A
N$48
  Top 0.305: D31.A 67.68,41.06 SW33.SW2
N$49
  Top 0.305: D32.A 80.55,50.17 SW32.SW2
N$50
  Top 0.305: SW31.SW2 94.71,50.58 93.25,49.12 D33.A
N$51
  Top 0.305: 92.93,45.47 93.57,45.47
N$52
  Top 0.305: 14.83,56.74 14.83,57.37
N$53
  Top 0.305: 23.08,60.87 23.72,60.87
N$54
  Top 0.305: 2.13,72.93 2.76,72.93
N$55
  Top 0.305: 14.51,41.18 14.51,40.55
N$56
  Top 0.305: 13.56,32.92 14.19,32.92
N$57
  Top 0.305: 4.67,18.16 5.3,18.16
N$58
  Top 0.305: 43.72,16.41 43.72,15.78
N$59
  Top 0.305: 24.99,18.16 25.62,18.16
N$60
  Top 0.305: 48.48,37.69 48.48,37.05
N$61
  Top 0.305: 64.83,18.16 64.04,18.16
N$62
  Top 0.305: 77.38,18.16 78.01,18.16
N$63
  Top 0.305: 102.46,18.16 101.82,18.16
N$64
  Top 0.305: 51.02,32.92 50.7,32.92
N$65
  Top 0.305: 42.77,72.93 43.4,72.93
N$66
  Top 0.305: 93.09,65.47 93.41,65.47
N$67
  Top 0.305: 93.09,61.02 93.41,61.02
N$68
  Top 0.305: 65.94,32.92 65.31,32.92
N$69
  Top 0.305: 80.87,39.59 80.23,39.59
N$70
  Top 0.305: 19.59,41.18 19.59,40.55
N$71
  Top 0.305: 85,32.92 85.63,32.92
N$72
  Top 0.305: 103.09,32.61 103.73,32.61
N$73
  Top 0.305: 6.1,78.96 6.1,78.33
N$74
  Top 0.305: 37.53,69.12 37.53,68.48
N$75
  Top 0.305: 88.49,79.28 89.12,79.28
N$76
  Top 0.305: 59.75,83.72 59.75,83.09
N$77
  Top 0.305: 59.28,87.53 59.59,87.53
N$78
  Top 0.305: 107.22,81.34 107.86,81.34
N$79
  Top 0.305: 58.33,68.17 58.96,68.17
N$80
  Top 0.305: 89.44,23.72 89.44,22.61 | 89.44,21.5 89.44,22.61 | 89.44,22.61 90.39,22.61 | 90.39,22.61 90.39,23.72 | 90.39,22.61 90.39,21.5
N$81
  Top 0.305: 91.98,23.72 91.5,23.72 91.34,23.56 91.34,22.77 91.5,22.61 91.82,22.61 91.98,22.45 91.98,21.65 91.82,21.5 91.34,21.5
N$82
  Top 0.305: 64.99,76.42 64.99,75.47
N$83
  Top 0.305: 32.29,32.92 31.66,32.92
N$84
  Top 0.305: 12.61,68.17 13.24,68.17
N$85
  Top 0.305: 23.08,51.98 23.08,51.34
N$86
  Top 0.305: IC1.1 11.71,68.54 12.61,69.44 R15.2
N$87
  Top 0.305: IC3.1 97.38,59.38 R17.2
N$88
  Top 0.305: 54.2,25.62 54.83,25.62
N$89
  Top 0.305: IC2.1 54.2,26.57 R16.2
N$90
  Top 0.305: 98.33,60.23 99.28,60.23
PB0_KEYINT  (via drill 0.61 pad 0.61)
  Top 0.305: 50.41,57.62 U4.8 47.81,60.23 v39.27,60.23 | v37.05,46.26 v37.05,31.02 | v56.1,32.92 60.23,28.8 62.45,28.8 64.04,30.38 v64.36,30.38 64.56,30.38 D37.A | D39.A 101.82,32.73 101.82,33.88 v100.87,34.83 | D38.A 84.24,31.46 83.41,32.29 v83.41,34.83 | D36.A 51.66,30.51 v51.66,30.38 | D34.A 15.58,29.75 25.62,29.75 27.53,31.66 v30.7,31.66 30.9,31.46 D35.A
  Bottom 0.305: v37.05,46.26 37.05,55.78 39.27,58.01 v39.27,60.23 | 51.66,32.92 47.53,32.92 43.72,29.11 38.96,29.11 v37.05,31.02 36.42,31.66 v30.7,31.66 | 51.66,32.92 v56.1,32.92 | v64.36,30.38 65.94,31.97 73.88,31.97 76.74,34.83 v83.41,34.83 v100.87,34.83 | v51.66,30.38 51.66,32.92
PB1_SCK  (via drill 0.61)
  Top 0.305: v34.51,61.98 36.26,61.98 38.96,59.28 47.63,59.28 U4.9 | J5.3 9.43,77.38 14.51,77.38 14.83,77.69 26.27,77.69 28.8,80.22 U1.4 31.29,80.23 32.62,80.23 33.9,81.5 v34.2,81.5 | IC4.1 24.89,52.51 32.61,60.23 v33.88,60.23
  Bottom 0.305: v34.2,81.5 34.2,81.11 35.09,80.21 35.09,78.67 34.2,77.77 34.2,62.77 34.51,62.45 v34.51,61.98 34.51,61.5 33.88,60.87 v33.88,60.23
PB2_MOSI  (via drill 0.61, 0.61 pad 0.61)
  Top 0.305: U4.10 47.13,58.64 38.32,58.64 v38.01,58.96 | IC1.9 8.11,62.08 v7.21,61.18 | v34.21,79.28 33.75,78.82 U1.6 29.29,78.82 26.89,76.42 23.52,76.42 23.42,76.52 21.6,76.52 21.5,76.42 16.1,76.42 11.21,71.53 8.48,71.53 7.53,72.49 J5.4
  Bottom 0.305: v38.01,58.96 33.56,58.96 32.92,59.59 32.92,62.45 33.58,63.11 33.58,78.64 v34.21,79.28 | J5.4 5.94,71.34 4.99,71.34 4.99,63.41 v7.21,61.18
PB3_MISO  (via drill 0.61)
  Top 0.305: U4.11 46.64,58.01 37.69,58.01 v35.78,59.91 | v36.1,80.55 33.94,80.55 32.91,79.52 U1.5 29.05,79.52 26.59,77.06 15.14,77.06 14.83,76.74 14.53,76.74 13.26,75.47 J5.1
  Bottom 0.305: v36.1,80.55 35.87,80.32 35.87,77.84 34.83,76.81 34.83,63.72 35.78,62.77 v35.78,59.91
PB4_BLE_CS  (via drill 0.61)
  Top 0.305: U1.7 36.21,78.12 v36.73,78.64 | U4.28 58.33,51.98 v57.53,51.98
  Bottom 0.305: v36.73,78.64 36.73,77.61 37.07,77.27 37.07,75.79 36.44,75.15 36.44,64.34 38.96,61.82 39.91,61.82 41.18,60.55 41.18,57.71 40.58,57.12 40.58,51.95 43.74,48.8 54.85,48.8 57.53,51.48 v57.53,51.98
PB5_BLE_RST  (via drill 0.61)
  Top 0.305: J4.3 42.45,80.87 40.98,80.87 U1.35 39.01,80.92 38.32,80.23 v38.32,77.69 | U4.29 58.33,53.11 v58.33,54.2
  Bottom 0.305: v38.32,77.69 37.71,77.08 37.71,75.48 37.05,74.82 37.05,64.67 39.27,62.45 40.24,62.45 42.13,60.56 42.13,57.35 41.2,56.42 41.2,52.29 44.04,49.45 54.53,49.45 56.53,51.45 56.53,52.64 58.09,54.2 v58.33,54.2
PB6_BLE_IRQ  (via drill 0.61)
  Top 0.305: U1.8 35.42,77.42 v36.1,76.74 | U4.30 61.18,51.38 61.18,50.7 v60.55,50.07
  Bottom 0.305: v36.1,76.74 35.47,76.11 35.47,64.36 38.64,61.18 39.59,61.18 40.55,60.23 40.55,57.99 39.93,57.37 39.93,51.64 43.4,48.16 58.64,48.16 v60.55,50.07
PB7_LED_SS
  Top 0.305: IC4.2 20.86,51.34 21.5,50.7 28.48,50.7 29.43,49.75 31.34,49.75 33.88,52.29 36.1,52.29 36.42,51.98 39.59,51.98 40.55,52.93 47.27,52.93 U4.12
PC6  (via drill 0.61)
  Top 0.305: U4.31 62.67,51.02 66.26,51.02 v67.22,51.98
PC7  (via drill 0.61)
  Top 0.305: U4.32 62.85,51.98 64.99,51.98 v65.63,52.61
PD0_SCL  (via drill 0.61)
  Top 0.305: v52.61,51.98 52.61,51.48 U4.18 50.07,48.94 50.07,47.53 49.12,46.58 R13.2 | J2.RING1 96.42,82.52 96.42,75.15 v96.74,74.83 | v40.55,64.67 34.2,64.67 26.57,57.05 v25.3,57.05 | J3.RING1 16.29,84.55 v16.1,84.36
  Bottom 0.305: v96.74,74.83 96.74,74.2 82.77,60.23 70.87,60.23 70.39,60.71 60.39,60.71 60.39,60.69 57.07,57.37 57.07,56.1 54.85,53.88 54.85,52.93 53.9,51.98 v52.61,51.98 | v52.61,51.98 52.52,51.98 | v40.55,64.67 40.55,64.04 43.4,61.18 43.4,57.37 43.72,57.05 43.72,54.2 43.4,53.88 43.4,53.24 43.92,52.72 51.86,52.72 v52.61,51.98 | v25.3,57.05 21.18,61.18 21.18,78.01 16.1,83.09 v16.1,84.36
PD1_SDA  (via drill 0.61)
  Top 0.305: v53.56,51.02 53.28,51.02 U4.19 51.02,48.76 51.02,45.94 R14.2 | J2.TIP 98.45,75.35 v98.65,75.15 | v39.27,63.72 34.2,63.72 26.57,56.1 v23.72,56.1 | J3.TIP 16.73,80.55 v16.41,80.23
  Bottom 0.305: v98.66,75.15 v98.65,75.15 98.65,75.14 83.11,59.59 70.72,59.59 70.41,59.91 66.92,59.91 66.76,60.07 60.71,60.07 57.69,57.05 57.69,55.77 55.48,53.57 55.48,52.61 53.9,51.02 v53.56,51.02 52.31,51.02 51.21,52.12 43.57,52.12 | 43.61,52.09 43.57,52.12 | 43.57,52.12 42.77,52.93 42.77,54.2 43.09,54.52 43.09,56.74 42.77,57.05 42.77,60.87 39.91,63.72 v39.27,63.72 | 23.72,56.74 v23.72,56.1 23.72,57.69 20.23,61.18 20.23,77.38 17.37,80.23 v16.41,80.23
PD2_ROW3  (via drill 0.61)
  Top 0.305: v69.12,38.32 69.56,38.76 D31.C D32.C 84.8,38.76 v86.27,40.23 | D33.C 93.25,42.13 v91.34,40.23 | D29.C v17.05,40.86 D28.C | U4.20 51.98,48.58 51.98,47.21 52.76,46.42 52.76,42.61 51.66,41.5 v51.66,38.32 50.7,37.37 D30.C
  Bottom 0.305: v69.12,38.32 68.48,37.69 55.42,37.69 55.19,37.92 54.48,37.92 54.25,37.69 52.29,37.69 v51.66,38.32 42.45,38.32 37.69,43.09 28.16,43.09 25.62,40.55 17.37,40.55 v17.05,40.86 | v86.27,40.23 v91.34,40.23
PD3_ROW2  (via drill 0.61)
  Top 0.305: 23.4,59.59 27.65,59.59 D12.C 36.85,68.05 38.01,66.9 43.4,66.9 45.31,68.8 50.07,68.8 51.98,66.9 58.01,66.9 | 58.01,66.9 58.2,66.9 D13.C | D15.C D14.C 82.58,61.7 80.55,63.72 78.96,63.72 v76.74,61.5 | U4.21 54.52,49.99 54.52,52.61 v53.88,53.24 | v58.01,65.94 58.01,66.9 | D11.C 23.4,59.59 | D10.C 20.86,57.05 23.4,59.59
  Bottom 0.305: v58.01,65.94 62.61,61.34 | 62.61,61.34 76.58,61.34 v76.74,61.5 | v53.88,53.24 53.88,53.88 56.42,56.42 56.42,57.69 60.07,61.34 62.61,61.34
PD4_ROW5  (via drill 0.61, 0.61 pad 0.61)
  Top 0.305: D16.C 6.06,19.91 v24.04,19.91 24.23,19.91 D17.C | 44.87,16.41 v53.56,16.41 v59.59,16.41 61.18,16.41 63.6,18.84 D19.C | D20.C 78.45,19.59 v79.6,19.59 101.39,19.59 D21.C | v53.56,30.7 53.56,40.55 58.12,45.1 58.35,45.1 58.85,45.59 58.85,48.06 U4.25 | 44.87,16.41 D18.C | 44.87,16.41 43.92,17.37 v32.29,17.37
  Bottom 0.305: v59.59,16.41 62.77,19.59 v79.6,19.59 | v53.56,30.7 v53.56,16.41 | v24.04,19.91 26.57,17.37 v32.29,17.37
PD6_ROW4  (via drill 0.61)
  Top 0.305: D27.C 94.72,37.05 v91.98,37.05 | D26.C 74.64,36.93 v74.52,37.05 v69.75,37.05 | D25.C 54.95,36.93 v54.83,37.05 54.83,40.86 58.3,44.33 58.54,44.33 59.62,45.41 59.62,48.42 U4.26 | D24.C 41.06,36.93 v41.18,37.05 | v19.59,37.05 19.71,36.93 D23.C 29.55,36.93 v30.7,35.78 | D22.C 5.74,36.93 v5.62,37.05
  Bottom 0.305: v69.75,37.05 v54.83,37.05 v41.18,37.05 31.97,37.05 v30.7,35.78 | v5.62,37.05 v19.59,37.05 | v74.52,37.05 v91.98,37.05
PD7_ROW1  (via drill 0.61, 0.61 pad 0.61)
  Top 0.305: D7.C 60.43,83.84 v59.28,85 D6.C | v24.99,79.92 24.87,79.92 D5.C 23.28,78.33 14.19,78.33 v13.88,78.64 | v64.36,49.12 63.09,49.12 62.45,48.48 60.69,48.48 U4.27 | v68.48,49.12 71.34,51.98 v71.34,63.41 | D3.C v9.11,78.64 | D9.C v107.54,77.06 | v88.81,81.82 D8.C 81.42,80.11 80.51,79.2 77.3,79.2 74.52,76.42 72.61,76.42 v71.98,75.79 | v37.69,81.82 37.69,82.45 36.1,84.04 30.38,84.04 v30.07,83.72
  Bottom 0.305: v71.34,63.41 71.34,75.15 v71.98,75.79 71.98,78.63 72,78.64 69.77,80.87 63.41,80.87 61.5,82.77 61.5,84.04 60.55,85 v59.28,85 54.2,85 51.02,81.82 47.53,81.82 45.31,79.6 39.91,79.6 v37.69,81.82 | v13.88,78.64 v9.11,78.64 | v88.81,81.82 91.03,81.82 95.79,77.06 v107.54,77.06 | v64.36,49.12 v68.48,49.12 | v24.99,79.92 26.17,81.09 27.5,81.09 28.91,82.5 28.91,82.56 v30.07,83.72
PF0_COL6  (via drill 0.61)
  Top 0.305: SW26.SW1 3.69,55.66 SW36.SW1 10.48,47.21 10.38,47.21 10.38,33.88 | 10.38,33.88 10.38,29.97 SW46.SW1 | v45.31,55.78 44.35,54.83 34.83,54.83 34.51,55.15 33.24,55.15 v32.29,54.2 | v51.34,56.42 51.96,56.42 53.69,58.15 55.88,58.15 U4.41 | D34.C 10.5,33.76 10.38,33.88
  Bottom 0.305: SW16.SW1 4.96,79.89 2.45,77.38 2.46,77.38 1.83,76.74 1.83,69.44 2.45,68.82 2.45,63.2 SW26.SW1 | SW46.SW1 10.38,28.11 10.38,10.97 SW56.SW1 | v51.34,56.42 50.7,56.42 50.39,56.1 45.62,56.1 v45.31,55.78 | SW36.SW1 13.09,46.26 22.45,46.26 24.35,48.16 27.84,48.16 28.8,49.12 28.8,51.34 31.66,54.2 v32.29,54.2
PF1_COL5  (via drill 0.61)
  Top 0.305: v45.31,54.52 44.99,54.2 38.32,54.2 37.05,52.93 33.24,52.93 31.02,50.7 v30.38,50.7 | SW45.SW1 30.23,28.96 | 30.23,28.96 29.43,28.16 29.43,10.92 SW55.SW1 | v50.39,55.15 51.57,55.15 53.8,57.37 56.24,57.37 U4.40 | SW35.SW2 30.31,41.69 30.31,44.6 v30.38,44.67 | v29.75,56.1 30.38,55.47 v30.38,50.7 | 30.38,51.41 v30.38,50.7 | 30.23,28.96 31.5,28.96 33.24,30.7 33.24,33.24 32.73,33.76 D35.C
  Bottom 0.305: SW15.SW1 23.96,73.39 SW25.SW1 30.31,56.66 v29.75,56.1 | v50.39,55.15 49.98,55.15 49.67,55.47 46.26,55.47 v45.31,54.52 | 29.43,29.92 SW45.SW1 29.04,30.31 SW35.SW2 | v30.38,50.7 v30.38,44.67
PF4_COL4  (via drill 0.61)
  Top 0.305: 49.31,32.1 SW44.SW1 | SW34.SW1 41.69,39.72 49.31,32.1 | U4.39 56.42,56.42 v54.36,56.42 | v47.21,54.52 46.26,53.56 39.27,53.56 v38.96,53.24 | D36.C 49.31,32.36 49.31,32.1
  Bottom 0.305: v47.21,54.52 49.12,54.52 49.44,54.2 51.34,54.2 53.56,56.42 v54.36,56.42 53.88,56.42 49.31,60.99 SW24.SW1 53.26,70.99 53.26,77.38 50.95,79.69 SW14.SW1 | SW34.SW1 41.69,45.43 38.96,48.16 v38.96,53.24 | SW44.SW1 49.31,28.99 48.48,28.16 48.48,10.87 SW54.SW1
PF5_COL3  (via drill 0.61, 0.61 pad 0.61)
  Top 0.305: SW33.SW1 60.69,40.4 66.42,34.67 | SW43.SW1 68.31,32.78 66.42,34.67 | SW23.SW1 68.31,63.86 65.31,60.87 62,60.87 U4.38 58.64,57.51 58.64,56.74 v59.59,55.78 | SW53.SW1 73.56,15.3 v73.56,21.18 | D37.C 66.42,34.55 66.42,34.67
  Bottom 0.305: SW33.SW1 60.87,43.13 60.87,47.21 62.14,48.48 62.14,53.24 v59.59,55.78 | SW23.SW1 69.44,68.17 69.44,76.11 67.12,78.42 SW13.SW2 | SW43.SW1 68.31,26.43 v73.56,21.18
PF6_COL2  (via drill 0.61)
  Top 0.305: U4.37 62.17,59.91 66.9,59.91 v69.12,57.69 | SW22.SW1 79.6,61.87 v79.6,57.69 87.31,49.98 SW32.SW1 87.31,43.31 88.81,41.81 88.81,33.56 | 88.81,33.56 88.81,30.53 SW42.SW1 | D38.C 88.61,33.76 88.81,33.56
  Bottom 0.305: SW12.SW1 SW22.SW1 | SW42.SW1 87.31,28.89 86.58,28.16 86.58,10.77 SW52.SW1 | v69.12,57.69 69.44,58.01 79.28,58.01 v79.6,57.69
PF7_COL1  (via drill 0.61)
  Top 0.305: 106.36,66.99 106.9,66.45 106.9,48.63 SW31.SW1 106.31,47.57 105.63,46.9 105.63,33.56 | 106.36,66.99 SW21.SW1 | SW51.SW1 106.31,25.45 105.94,25.82 105.94,27.18 106.31,27.55 SW41.SW1 105.63,29.72 105.63,33.56 | U4.36 61.72,58.33 64.99,58.33 v66.9,56.42 | D39.C 105.51,33.44 105.63,33.56 | SW11.SW1 105.04,72.57 106.36,71.25 106.36,66.99
  Bottom 0.305: v66.9,56.42 68.48,54.83 101.82,54.83 106.31,50.34 SW31.SW1
RST  (via drill 0.61, 0.61 pad 0.61)
  Top 0.305: U4.13 47.77,52.29 41.18,52.29 40.23,51.34 v35.15,51.34 | v28.8,74.2 28.1,74.9 S2.2 S2.1 16.41,75.79 11.65,71.03 5.32,71.03 v4.05,69.75
  Bottom 0.305: v28.8,74.2 28.8,71.13 32.07,67.86 32.07,65.39 31.04,64.36 31.04,59.28 32.62,57.69 34.2,57.69 35.15,56.74 v35.15,51.34 | J5.5 3.42,73.9 3.42,70.39 v4.05,69.75
SWCLK
  Top 0.305: U1.36 42.65,81.62 46.9,77.38 48.48,77.38 J4.1
VBAT
  Top 0.305: CN1.1 80.55,72.79 | 80.55,72.79 76.94,72.79 76.49,73.25 C3.1 69.75,73.25 | 80.55,72.79 80.55,71.66 74.2,65.31 R3.1 | U3.3 69.75,73.25 | D4.A 70.02,73.51 69.75,73.25
VBUS  (via drill 0.61)
  Top 0.254: J1.A9 72.7,84.13 72.95,84.38 J1.B4 72.95,85.92 v72.3,86.58
  Top 0.305: v72.3,86.58 72.3,88.17 73.25,89.12 74.2,89.12 75.45,87.87 J1.B9 75.45,84.5 75.2,84.25 J1.A4 75.2,80.13 75.38,79.95 75.38,79.24 74,77.86 70.89,77.86 70.41,77.38 68.82,77.38 67.23,75.79 D4.C 66.32,74.89 v64.67,73.25 | U2.1 R9.1 C6.1 64.36,72.93 v64.67,73.25 | U4.7 51.16,58.01 51.98,58.01 53.56,59.59 v53.88,59.59 | v64.67,73.25 v64.68,73.25 U3.4
  Bottom 0.305: MOB.A 72.3,88.9 v72.3,86.58 | v64.67,73.25 62.45,73.25 53.88,64.67 v53.88,59.59
(copper drawn outside any net)
  shapes: Top circle x1